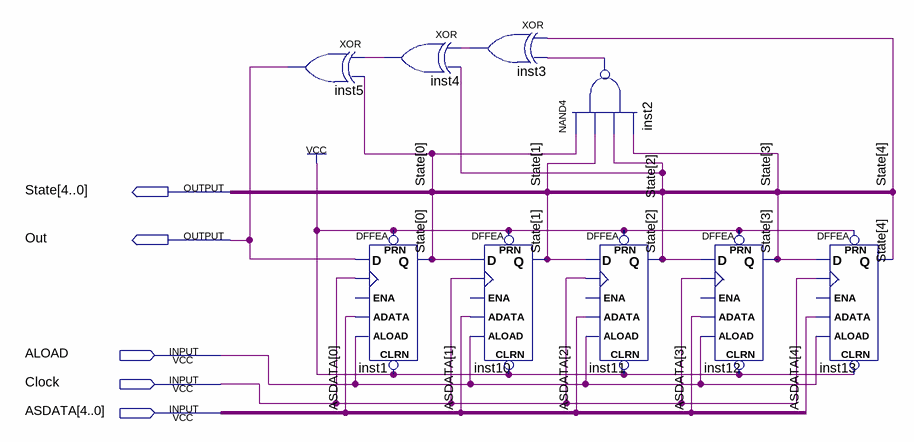
[diagram p0: schematic sheet]
// Quartus schematic deBruijn.bdf as structural Verilog: 9 symbols, 5 pins
module deBruijn (
  input  ALOAD,
  input  Clock,
  input  [4:0] ASDATA,
  output [4:0] State,
  output Out
);

  wire inst2_out, inst3_out, inst4_out;

  xor inst5 (Out, inst4_out, State[0]);
  xor inst4 (inst4_out, inst3_out, State[2]);
  DFFEA inst1 (
    .PRN(1'b1), .ALOAD(ALOAD), .ADATA(ASDATA[0]), .CLK(Clock), .D(Out), .CLRN(1'b1), .Q(State[0]));  // open: ENA
  xor inst3 (inst3_out, State[4], inst2_out);
  DFFEA inst10 (
    .PRN(1'b1), .ALOAD(ALOAD), .ADATA(ASDATA[1]), .CLK(Clock), .D(State[0]), .CLRN(1'b1), .Q(State[1]));  // open: ENA
  nand inst2 (inst2_out, State[0], State[1], State[2], State[3]);
  DFFEA inst11 (
    .PRN(1'b1), .ALOAD(ALOAD), .ADATA(ASDATA[2]), .CLK(Clock), .D(State[1]), .CLRN(1'b1), .Q(State[2]));  // open: ENA
  DFFEA inst12 (
    .PRN(1'b1), .ALOAD(ALOAD), .ADATA(ASDATA[3]), .CLK(Clock), .D(State[2]), .CLRN(1'b1), .Q(State[3]));  // open: ENA
  DFFEA inst13 (
    .PRN(1'b1), .ALOAD(ALOAD), .ADATA(ASDATA[4]), .CLK(Clock), .D(State[3]), .CLRN(1'b1), .Q(State[4]));  // open: ENA
endmodule
